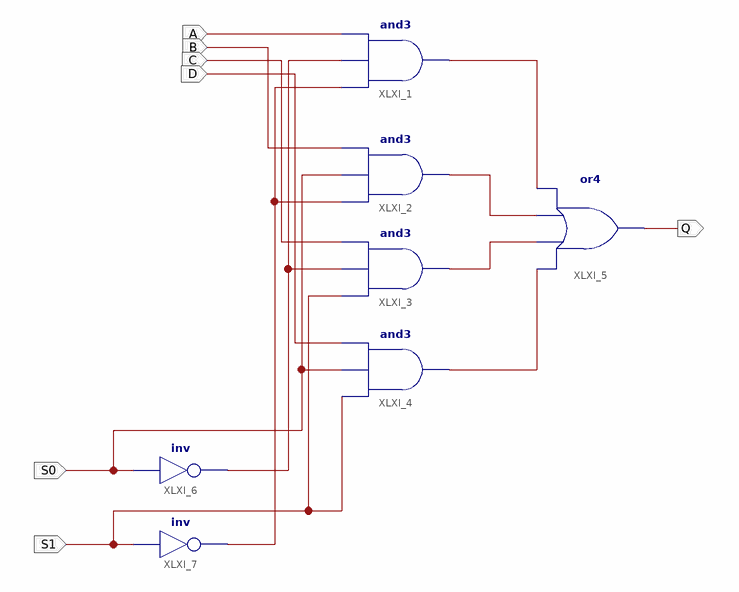
[diagram p0: schematic sheet 1]
// Xilinx ISE schematic MUX4B2S.sch (spartan6) as structural Verilog: 7 symbols, 7 ports
module MUX4B2S (
  input  A,
  input  B,
  input  C,
  input  D,
  input  S1,
  input  S0,
  output Q
);

  wire XLXN_1, XLXN_2, XLXN_3, XLXN_4, XLXN_15, XLXN_16;

  and XLXI_1 (XLXN_1, XLXN_16, XLXN_15, A);
  and XLXI_2 (XLXN_2, XLXN_16, S0, B);
  and XLXI_3 (XLXN_3, S1, XLXN_15, C);
  and XLXI_4 (XLXN_4, S1, S0, D);
  or XLXI_5 (Q, XLXN_4, XLXN_3, XLXN_2, XLXN_1);
  not XLXI_6 (XLXN_15, S0);
  not XLXI_7 (XLXN_16, S1);
endmodule
